# EAGLE design Retr3dRTMini (EAGLE 7.2.0)
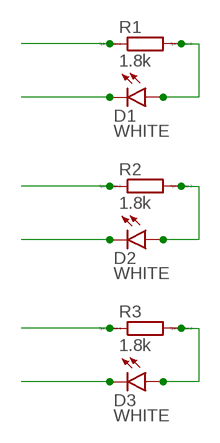
[diagram p0: schematic, sheet 1]

## Parts
D1  WHITE  LED-WHITE1206  [LED-1206]
D2  WHITE  LED-WHITE1206  [LED-1206]
D3  WHITE  LED-WHITE1206  [LED-1206]
R1  1.8k  R  [R0805]
R2  1.8k  R  [R0805]
R3  1.8k  R  [R0805]

## Nets
N$19: D1.A R1.2
N$21: D2.A R2.2
N$23: D3.A R3.2
S1: D1.C
S2: R1.1
S3: D2.C
S4: R2.1
S5: D3.C
S6: R3.1

## Library data of the parts
D1-D3 = SparkFun-LED:LED-WHITE: White SMD LEDs LilyPad 1206- DIO-09955; PROD_ID: DIO-09955
R1-R3 = eagle-ltspice:R: RESISTOR, European symbol; SPICEMODEL: NONE; SPICEPREFIX: R

## Board
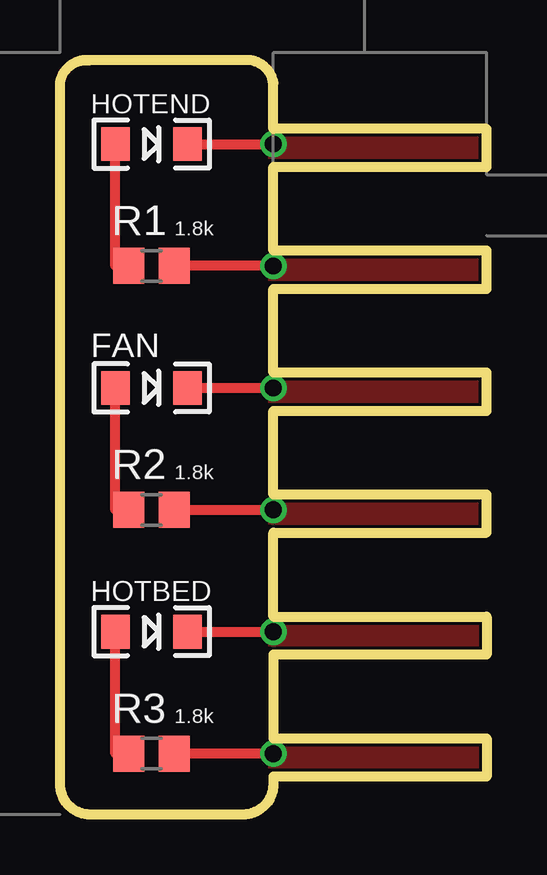
[diagram p1: board, top side]
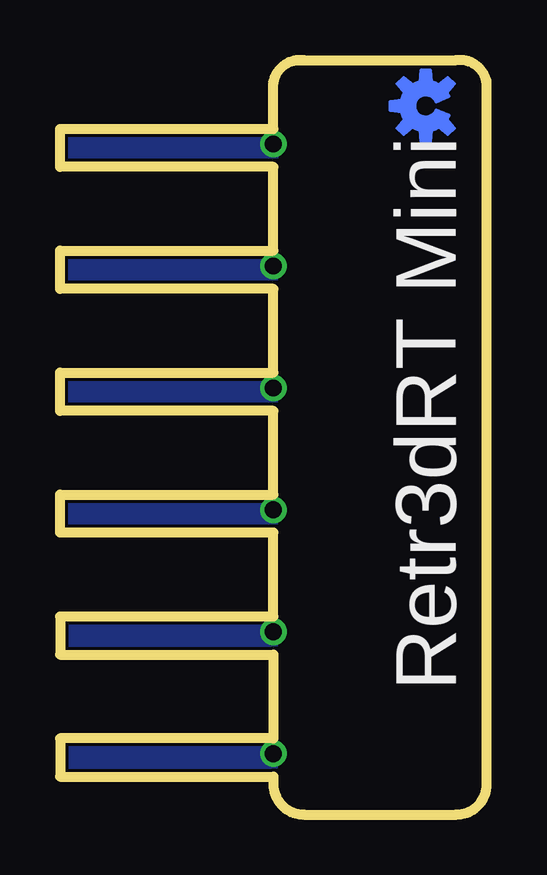
[diagram p2: board, bottom side, seen from below]

Size 17.78 x 31.44 mm. Coordinates in mm from the lower left corner, seen from the top.
Outline: 8.89,11.75 17.78,11.75 17.78,13.33 8.89,13.33 8.89,16.83 17.78,16.83 17.78,18.42 8.89,18.42 8.89,21.91 17.78,21.91 17.78,23.5 8.89,23.5 8.89,26.99 17.78,26.99 17.78,28.57 8.89,28.57 8.89,30.48 arc90 7.62,31.43 1.27,31.43 arc90 0,30.48 0,1.27 arc90 1.27,0 7.62,0 arc90 8.89,1.27 8.89,1.59 17.78,1.59 17.78,3.18 8.89,3.18 8.89,6.67 17.78,6.67 17.78,8.25 8.89,8.25 8.89,11.75
Copper layers (1*16): Top 0.035mm / dielectric 1.5mm / Bottom 0.035mm
Design rules "default *": minimum track width 10mil, minimum drill 24mil, track to track 8mil, track to pad 8mil, pad to pad 8mil, via to via 8mil, smd to smd 8mil, copper to edge 5mil, drill to drill 8mil, minimum pad ring 10mil, minimum via ring 8mil, stop-mask expansion 4mil, vias tented up to drill 0mil, thermal gap 10mil

### Footprints (pad centres in the part's own frame; a part is rotated, then mirrored left to right if it is on the bottom)
LED-1206 = smd 1.2 x 1.4: A -1.5,0; C 1.5,0
R0805 = smd 1.3 x 1.5: 1 -0.95,0; 2 0.95,0

### Placement (x,y rotation side)
D1  3.81,27.94 0 top
D2  3.81,17.78 0 top
D3  3.81,7.62 0 top
R1  3.81,22.86 180 top
R2  3.81,12.7 180 top
R3  3.81,2.54 180 top
U$1  [OSHW-LOGO-S_COPPER]  2.54,29.53 270 top

### Tracks (layer width: path | path; a pad name or v marks a point on that pad's centre or on a via)
N$19
  Top 0.406: R1.2 2.31,22.86 D1.A
N$21
  Top 0.406: R2.2 2.31,12.7 D2.A
N$23
  Top 0.406: R3.2 2.31,2.54 D3.A
S1  (via drill 0.7)
  Top 0.406: D1.C v8.89,27.94
  pour Top: 8.89,28.89 17.78,28.89 17.78,26.99 8.89,26.99
  pour Bottom: 17.78,28.89 8.89,28.89 8.89,26.99 17.78,26.99
S2  (via drill 0.7)
  Top 0.406: v8.89,22.86 R1.1
  pour Top: 8.89,23.81 17.78,23.81 17.78,21.91 8.89,21.91
  pour Bottom: 17.78,21.91 8.89,21.91 8.89,23.81 17.78,23.81
S3  (via drill 0.7)
  Top 0.406: D2.C v8.89,17.78
  pour Top: 8.89,18.73 17.78,18.73 17.78,16.83 8.89,16.83
  pour Bottom: 8.89,18.73 17.78,18.73 17.78,16.83 8.89,16.83
S4  (via drill 0.7)
  Top 0.406: R2.1 v8.89,12.7
  pour Top: 8.89,13.65 17.78,13.65 17.78,11.75 8.89,11.75
  pour Bottom: 8.89,13.65 17.78,13.65 17.78,11.75 8.89,11.75
S5  (via drill 0.7)
  Top 0.406: D3.C v8.89,7.62
  pour Top: 8.89,8.57 17.78,8.57 17.78,6.67 8.89,6.67
  pour Bottom: 17.78,6.67 8.89,6.67 8.89,8.57 17.78,8.57
S6  (via drill 0.7)
  Top 0.406: v8.89,2.54 R3.1
  pour Top: 8.89,3.49 17.78,3.49 17.78,1.59 8.89,1.59
  pour Bottom: 8.89,3.49 17.78,3.49 17.78,1.59 8.89,1.59

### Text on the board
tPlace: HOTEND | 1.8k | FAN | 1.8k | HOTBED | 1.8k
bPlace: Retr3dRT Mini